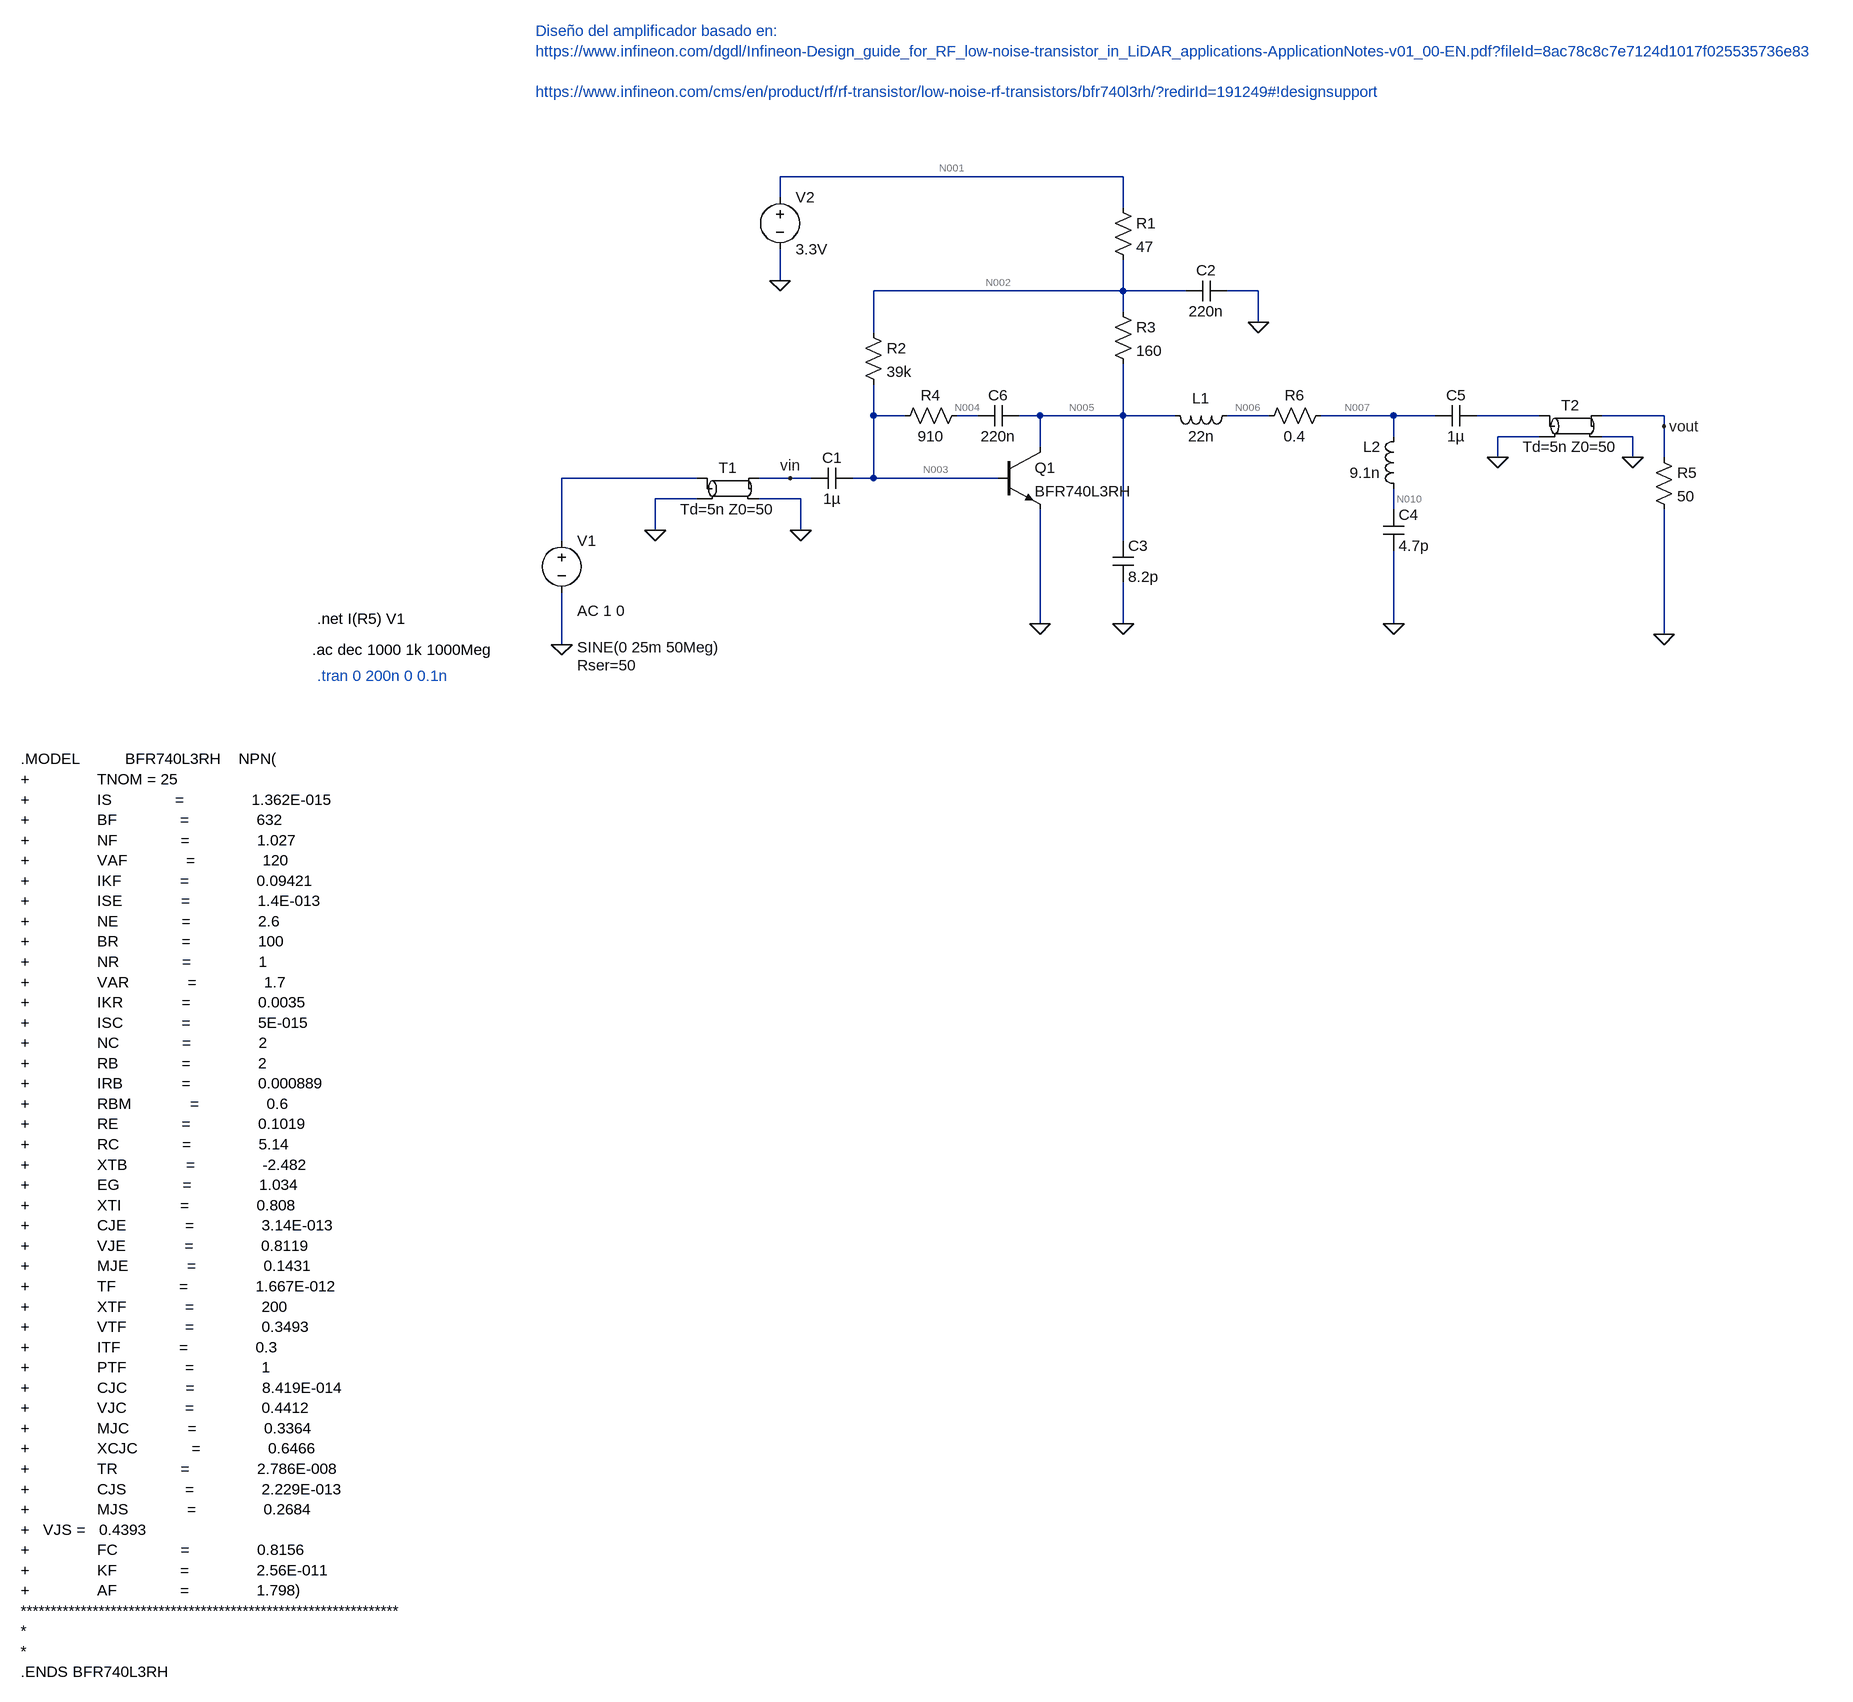
[diagram p0: schematic amplifier_tx.asc]
amplifier_tx.asc, the LTspice schematic file:
Version 4
SHEET 1 4756 1776
WIRE 592 -416 64 -416
WIRE 64 -384 64 -416
WIRE 592 -368 592 -416
WIRE 64 -256 64 -304
WIRE 592 -240 592 -288
WIRE 592 -240 208 -240
WIRE 688 -240 592 -240
WIRE 800 -240 752 -240
WIRE 592 -208 592 -240
WIRE 800 -192 800 -240
WIRE 208 -176 208 -240
WIRE 208 -48 208 -96
WIRE 256 -48 208 -48
WIRE 368 -48 336 -48
WIRE 464 -48 432 -48
WIRE 592 -48 592 -128
WIRE 592 -48 464 -48
WIRE 672 -48 592 -48
WIRE 816 -48 752 -48
WIRE 1008 -48 896 -48
WIRE 1072 -48 1008 -48
WIRE 1232 -48 1136 -48
WIRE 1424 -48 1328 -48
WIRE 1424 -32 1424 -48
WIRE 1008 -16 1008 -48
WIRE 1232 -16 1168 -16
WIRE 1376 -16 1328 -16
WIRE 464 0 464 -48
WIRE 1168 16 1168 -16
WIRE 1376 16 1376 -16
WIRE 1424 16 1424 -32
WIRE -64 48 -272 48
WIRE 80 48 32 48
WIRE 112 48 80 48
WIRE 208 48 208 -48
WIRE 208 48 176 48
WIRE 400 48 208 48
WIRE -64 80 -128 80
WIRE 96 80 32 80
WIRE 1008 96 1008 64
WIRE -128 128 -128 80
WIRE 96 128 96 80
WIRE -272 144 -272 48
WIRE 592 144 592 -48
WIRE 464 272 464 96
WIRE 592 272 592 208
WIRE 1008 272 1008 160
WIRE 1424 288 1424 96
WIRE -272 304 -272 224
FLAG -272 304 0
FLAG 464 272 0
FLAG 1424 288 0
FLAG 592 272 0
FLAG 1008 272 0
FLAG 800 -192 0
FLAG 64 -256 0
FLAG 1424 -32 vout
FLAG 80 48 vin
FLAG -128 128 0
FLAG 96 128 0
FLAG 1168 16 0
FLAG 1376 16 0
SYMBOL voltage -272 128 R0
WINDOW 123 24 124 Left 2
WINDOW 39 24 208 Left 2
WINDOW 3 24 180 Left 2
SYMATTR Value2 AC 1 0
SYMATTR SpiceLine Rser=50
SYMATTR Value SINE(0 25m 50Meg)
SYMATTR InstName V1
SYMBOL cap 176 32 R90
WINDOW 0 0 32 VBottom 2
WINDOW 3 32 32 VTop 2
SYMATTR InstName C1
SYMATTR Value 1µ
SYMBOL npn 400 0 R0
SYMATTR InstName Q1
SYMATTR Value BFR740L3RH
SYMBOL res 576 -384 R0
SYMATTR InstName R1
SYMATTR Value 47
SYMBOL res 192 -192 R0
SYMATTR InstName R2
SYMATTR Value 39k
SYMBOL res 576 -224 R0
SYMATTR InstName R3
SYMATTR Value 160
SYMBOL res 352 -64 R90
WINDOW 0 0 56 VBottom 2
WINDOW 3 32 56 VTop 2
SYMATTR InstName R4
SYMATTR Value 910
SYMBOL cap 752 -256 R90
WINDOW 0 0 32 VBottom 2
WINDOW 3 32 32 VTop 2
SYMATTR InstName C2
SYMATTR Value 220n
SYMBOL cap 576 144 R0
SYMATTR InstName C3
SYMATTR Value 8.2p
SYMBOL cap 992 96 R0
SYMATTR InstName C4
SYMATTR Value 4.7p
SYMBOL ind 768 -64 R90
WINDOW 0 5 56 VBottom 2
WINDOW 3 32 56 VTop 2
SYMATTR InstName L1
SYMATTR Value 22n
SYMBOL ind 1024 80 R180
WINDOW 0 36 80 Left 2
WINDOW 3 36 40 Left 2
SYMATTR InstName L2
SYMATTR Value 9.1n
SYMBOL cap 1136 -64 R90
WINDOW 0 0 32 VBottom 2
WINDOW 3 32 32 VTop 2
SYMATTR InstName C5
SYMATTR Value 1µ
SYMBOL res 1408 0 R0
SYMATTR InstName R5
SYMATTR Value 50
SYMBOL cap 432 -64 R90
WINDOW 0 0 32 VBottom 2
WINDOW 3 32 32 VTop 2
SYMATTR InstName C6
SYMATTR Value 220n
SYMBOL voltage 64 -400 R0
SYMATTR InstName V2
SYMATTR Value 3.3V
SYMBOL tline -16 64 R0
SYMATTR InstName T1
SYMATTR Value Td=5n Z0=50
SYMBOL tline 1280 -32 R0
SYMATTR InstName T2
SYMATTR Value Td=5n Z0=50
SYMBOL res 912 -64 R90
WINDOW 0 0 56 VBottom 2
WINDOW 3 32 56 VTop 2
SYMATTR InstName R6
SYMATTR Value 0.4
TEXT -656 312 Left 2 !.ac dec 1000 1k 1000Meg
TEXT -1104 480 Left 2 !.MODEL          BFR740L3RH    NPN(\n+               TNOM = 25\n+               IS              =               1.362E-015\n+               BF              =               632\n+               NF              =               1.027\n+               VAF             =               120\n+               IKF             =               0.09421\n+               ISE             =               1.4E-013\n+               NE              =               2.6\n+               BR              =               100\n+               NR              =               1\n+               VAR             =               1.7\n+               IKR             =               0.0035\n+               ISC             =               5E-015\n+               NC              =               2\n+               RB              =               2\n+               IRB             =               0.000889\n+               RBM             =               0.6\n+               RE              =               0.1019\n+               RC              =               5.14\n+               XTB             =               -2.482\n+               EG              =               1.034\n+               XTI             =               0.808\n+               CJE             =               3.14E-013\n+               VJE             =               0.8119\n+               MJE             =               0.1431\n+               TF              =               1.667E-012\n+               XTF             =               200\n+               VTF             =               0.3493\n+               ITF             =               0.3\n+               PTF             =               1\n+               CJC             =               8.419E-014\n+               VJC             =               0.4412\n+               MJC             =               0.3364\n+               XCJC            =               0.6466\n+               TR              =               2.786E-008\n+               CJS             =               2.229E-013\n+               MJS             =               0.2684\n+   VJS =   0.4393\n+               FC              =               0.8156\n+               KF              =               2.56E-011\n+               AF              =               1.798)\n***************************************************************\n*\n*\n.ENDS BFR740L3RH
TEXT -648 264 Left 2 !.net I(R5) V1
TEXT -648 352 Left 2 ;.tran 0 200n 0 0.1n
TEXT -312 -640 Left 2 ;Diseño del amplificador basado en:\nhttps://www.infineon.com/dgdl/Infineon-Design_guide_for_RF_low-noise-transistor_in_LiDAR_applications-ApplicationNotes-v01_00-EN.pdf?fileId=8ac78c8c7e7124d1017f025535736e83\n \nhttps://www.infineon.com/cms/en/product/rf/rf-transistor/low-noise-rf-transistors/bfr740l3rh/?redirId=191249#!designsupport

The netlist it stands for:
* amplifier_tx.asc
V1 N009 0 SINE(0 25m 50Meg) AC 1 0 Rser=50
C1 N003 vin 1µ
Q1 N005 N003 0 0 BFR740L3RH
R1 N001 N002 47
R2 N002 N003 39k
R3 N002 N005 160
R4 N004 N003 910
C2 0 N002 220n
C3 N005 0 8.2p
C4 N010 0 4.7p
L1 N006 N005 22n
L2 N010 N007 9.1n
C5 N008 N007 1µ
R5 vout 0 50
C6 N005 N004 220n
V2 N001 0 3.3V
T1 N009 0 vin 0 Td=5n Z0=50
T2 N008 0 vout 0 Td=5n Z0=50
R6 N007 N006 0.4
.model NPN NPN
.model PNP PNP
.lib standard.bjt
.ac dec 1000 1k 1000Meg
.MODEL          BFR740L3RH    NPN(
+               TNOM = 25
+               IS              =               1.362E-015
+               BF              =               632
+               NF              =               1.027
+               VAF             =               120
+               IKF             =               0.09421
+               ISE             =               1.4E-013
+               NE              =               2.6
+               BR              =               100
+               NR              =               1
+               VAR             =               1.7
+               IKR             =               0.0035
+               ISC             =               5E-015
+               NC              =               2
+               RB              =               2
+               IRB             =               0.000889
+               RBM             =               0.6
+               RE              =               0.1019
+               RC              =               5.14
+               XTB             =               -2.482
+               EG              =               1.034
+               XTI             =               0.808
+               CJE             =               3.14E-013
+               VJE             =               0.8119
+               MJE             =               0.1431
+               TF              =               1.667E-012
+               XTF             =               200
+               VTF             =               0.3493
+               ITF             =               0.3
+               PTF             =               1
+               CJC             =               8.419E-014
+               VJC             =               0.4412
+               MJC             =               0.3364
+               XCJC            =               0.6466
+               TR              =               2.786E-008
+               CJS             =               2.229E-013
+               MJS             =               0.2684
+   VJS =   0.4393
+               FC              =               0.8156
+               KF              =               2.56E-011
+               AF              =               1.798)
***************************************************************
*
*
.ENDS BFR740L3RH
.net I(R5) V1
* .tran 0 200n 0 0.1n
* Diseño del amplificador basado en:
* https://www.infineon.com/dgdl/Infineon-Design_guide_for_RF_low-noise-transistor_in_LiDAR_applications-ApplicationNotes-v01_00-EN.pdf?fileId=8ac78c8c7e7124d1017f025535736e83
* https://www.infineon.com/cms/en/product/rf/rf-transistor/low-noise-rf-transistors/bfr740l3rh/?redirId=191249#!designsupport
.backanno
.end

* Results of the author's LTspice run, read from the files saved beside the schematic
* Operating Point, zero values left out:
*   V(n003) = 810.4 mV
*   V(n005) = 694.7 mV
*   V(n001) = 3.3 V
*   V(n002) = 2.707 V
*   V(n004) = 810.4 mV
*   V(n010) = 694.7 mV
*   V(n006) = 694.7 mV
*   V(n007) = 694.7 mV
*   Ic(Q1) = 12.57 mA
*   Ib(Q1) = 48.62 µA
*   Ie(Q1) = -12.62 mA
*   I(R1) = 12.62 mA
*   I(R2) = 48.62 µA
*   I(R3) = 12.57 mA
*   I(V2) = -12.62 mA